# Altium schematic sheet stm32-motor4.SchDoc
size A4
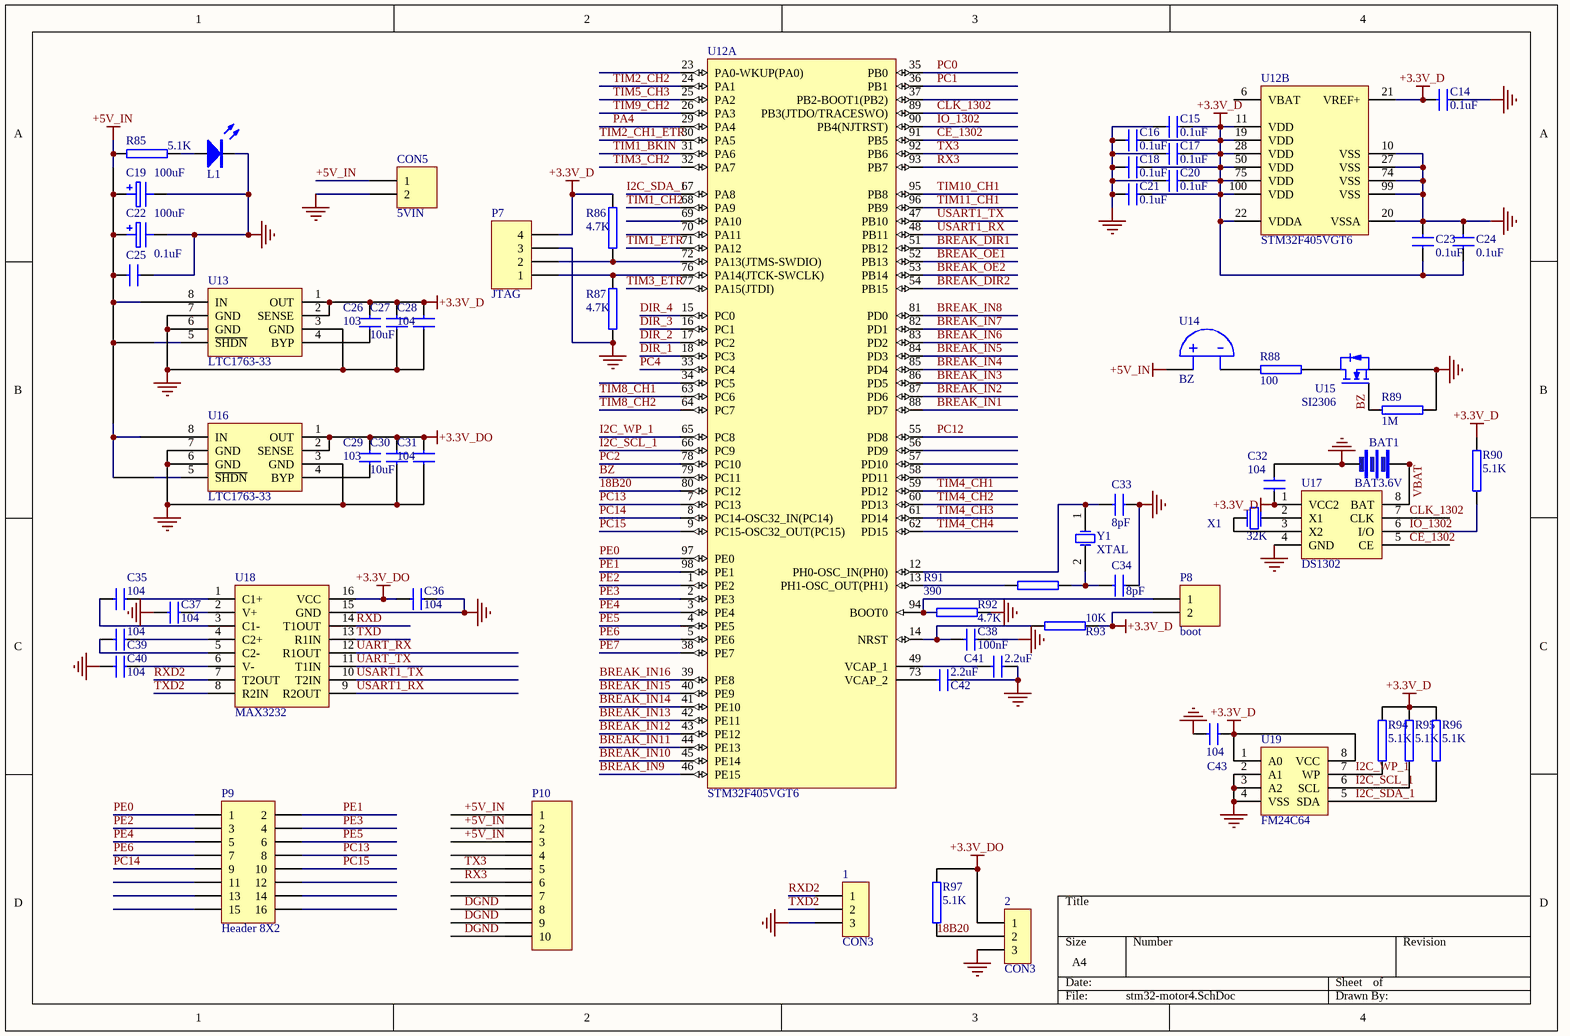
[diagram p0: stm32-motor4.SchDoc]

## Parts
1  CON3  [SIP3]
2  CON3  [SIP3]
BAT1  BAT3.6V  [BAT]
C14  0.1uF  [0805]
C15  0.1uF  [0805]
C16  0.1uF  [0805]
C17  0.1uF  [0805]
C18  0.1uF  [0805]
C19  100uF  [100UF/25V_CA]
C20  0.1uF  [0805]
C21  0.1uF  [0805]
C22  100uF  [100UF/25V_CA]
C23  0.1uF  [0805]
C24  0.1uF  [0805]
C25  0.1uF  [0805]
C26  103  [0603]
C27  10uF  [0805]
C28  104  [0805]
C29  103  [0603]
C30  10uF  [0805]
C31  104  [0805]
C32  104  [0805]
C33  8pF  [0805]
C34  8pF  [0805]
C35  104  [0805]
C36  104  [0805]
C37  104  [0805]
C38  100nF  [0805]
C39  104  [0805]
C40  104  [0805]
C41  2.2uF  [0805]
C42  2.2uF  [0805]
C43  104  [0805]
CON5  5VIN  [CON2]
L1  LED  [0805LED]  (value not drawn)
P7  JTAG  [HDR1X4]
P8  boot  [0603]
P9  Header 8X2  [HDR2X8]
P10  ping  [PCBComponent_1]  (value not drawn)
R85  5.1K  [0805]
R86  4.7K  [0805]
R87  4.7K  [0805]
R88  100  [0805]
R89  1M  [0805]
R90  5.1K  [0805]
R91  390  [0805]
R92  4.7K  [0805]
R93  10K  [0805]
R94  5.1K  [0805]
R95  5.1K  [0805]
R96  5.1K  [0805]
R97  5.1K  [0805]
U12  STM32F405VGT6  [STM-LQFP100_N]  (parts A,B of 2)
U13  LTC1763-33  [SO-8]
U14  BZ  [BZ_SMALL]
U15  SI2306  [SOT-23]
U16  LTC1763-33  [SO-8]
U17  DS1302  [SO-8]
U18  MAX3232  [SO-16]
U19  FM24C64  [SO-8]
X1  32K  [XTAL-2]
Y1  XTAL  [XTAL1]

## Nets
+3.3V_D: C14.1 C15.2 C16.2 C17.2 C18.2 C20.2 C21.2 C23.2 C24.2 C26.1 C27.1 C28.1 C32.2 C43.1 P7.4 P8.2 R86.1 R90.2 R93.2 R94.2 R95.2 R96.2 U12.11(VDD) U12.19(VDD) U12.21(VREF+) U12.22(VDDA) U12.28(VDD) U12.50(VDD) U12.75(VDD) U12.100(VDD) U13.1(OUT) U13.2(SENSE) U17.1(VCC2) U19.1(A0) U19.8(VCC)
+3.3V_DO: 2.1 C29.1 C30.1 C31.1 C36.1 R97.2 U16.1(OUT) U16.2(SENSE) U18.16(VCC)
+5V_IN: C19.1 C22.1 C25.1 CON5.1 P10.1 P10.2 P10.3 R85.2 U13.5(~{SHDN}) U13.8(IN) U14.1 U16.5(~{SHDN}) U16.8(IN)
DGND: 1.3 2.3 BAT1.2 C14.2 C15.1 C16.1 C17.1 C18.1 C19.2 C20.1 C21.1 C22.2 C23.1 C24.1 C25.2 C27.2 C28.2 C30.2 C31.2 C32.1 C33.2 C34.2 C36.2 C37.1 C38.2 C40.1 C41.2 C42.2 C43.2 CON5.2 L1.2(K) P7.3 P10.8 P10.9 P10.10 R87.2 R89.1 R92.1 U12.10(VSS) U12.20(VSSA) U12.27(VSS) U12.74(VSS) U12.99(VSS) U13.3(GND) U13.6(GND) U13.7(GND) U15.E U16.3(GND) U16.6(GND) U16.7(GND) U17.4(GND) U18.15(GND) U19.2(A1) U19.3(A2) U19.4(VSS)
18B20: 2.2 R97.1 U12.80(PC12)
BREAK_DIR1: U12.51(PB12)
BREAK_DIR2: U12.54(PB15)
BREAK_IN1: U12.88(PD7)
BREAK_IN2: U12.87(PD6)
BREAK_IN3: U12.86(PD5)
BREAK_IN4: U12.85(PD4)
BREAK_IN5: U12.84(PD3)
BREAK_IN6: U12.83(PD2)
BREAK_IN7: U12.82(PD1)
BREAK_IN8: U12.81(PD0)
BREAK_IN9: U12.46(PE15)
BREAK_IN10: U12.45(PE14)
BREAK_IN11: U12.44(PE13)
BREAK_IN12: U12.43(PE12)
BREAK_IN13: U12.42(PE11)
BREAK_IN14: U12.41(PE10)
BREAK_IN15: U12.40(PE9)
BREAK_IN16: U12.39(PE8)
BREAK_OE1: U12.52(PB13)
BREAK_OE2: U12.53(PB14)
BZ: R89.2 U12.79(PC11) U15.B
CE_1302: U12.91(PB5) U17.5(CE)
CLK_1302: U12.89(PB3(JTDO/TRACESWO)) U17.7(CLK)
DIR_1: U12.18(PC3)
DIR_2: U12.17(PC2)
DIR_3: U12.16(PC1)
DIR_4: U12.15(PC0)
I2C_SCL_1: R95.1 U12.66(PC9) U19.6(SCL)
I2C_SDA_1: R96.1 U12.67(PA8) U19.5(SDA)
I2C_WP_1: R94.1 U12.65(PC8) U19.7(WP)
IO_1302: R90.1 U12.90(PB4(NJTRST)) U17.6(I/O)
PA4: U12.29(PA4)
PC0: U12.35(PB0)
PC1: U12.36(PB1)
PC2: U12.78(PC10)
PC4: U12.33(PC4)
PC12: U12.55(PD8)
PC13: P9.8 U12.7(PC13)
PC14: P9.9 U12.8(PC14-OSC32_IN(PC14))
PC15: P9.10 U12.9(PC15-OSC32_OUT(PC15))
PE0: P9.1 U12.97(PE0)
PE1: P9.2 U12.98(PE1)
PE2: P9.3 U12.1(PE2)
PE3: P9.4 U12.2(PE3)
PE4: P9.5 U12.3(PE4)
PE5: P9.6 U12.4(PE5)
PE6: P9.7 U12.5(PE6)
PE7: U12.38(PE7)
RX3: P10.6 U12.93(PB7)
RXD: U18.14(T1OUT)
RXD2: 1.1 U18.7(T2OUT)
TIM1_BKIN: U12.31(PA6)
TIM1_CH2: U12.68(PA9)
TIM1_ETR: U12.71(PA12)
TIM2_CH1_ETR: U12.30(PA5)
TIM2_CH2: U12.24(PA1)
TIM3_CH2: U12.32(PA7)
TIM3_ETR: U12.77(PA15(JTDI))
TIM4_CH1: U12.59(PD12)
TIM4_CH2: U12.60(PD13)
TIM4_CH3: U12.61(PD14)
TIM4_CH4: U12.62(PD15)
TIM5_CH3: U12.25(PA2)
TIM8_CH1: U12.63(PC6)
TIM8_CH2: U12.64(PC7)
TIM9_CH2: U12.26(PA3)
TIM10_CH1: U12.95(PB8)
TIM11_CH1: U12.96(PB9)
TX3: P10.5 U12.92(PB6)
TXD: U18.13(R1IN)
TXD2: 1.2 U18.8(R2IN)
UART_RX: U18.12(R1OUT)
UART_TX: U18.11(T1IN)
USART1_RX: U12.48(PB11) U18.9(R2OUT)
USART1_TX: U12.47(PB10) U18.10(T2IN)
VBAT: BAT1.1 U17.8(BAT)
NetC26_2: C26.2 U13.4(BYP)
NetC29_2: C29.2 U16.4(BYP)
NetC33_1: C33.1 U12.12(PH0-OSC_IN(PH0)) Y1.1(OSC1)
NetC34_1: C34.1 R91.2 Y1.2(OSC2)
NetC35_1: C35.1 U18.3(C1-)
NetC35_2: C35.2 U18.1(C1+)
NetC37_2: C37.2 U18.2(V+)
NetC38_1: C38.1 R93.1 U12.14(NRST)
NetC39_1: C39.1 U18.5(C2-)
NetC39_2: C39.2 U18.4(C2+)
NetC40_2: C40.2 U18.6(V-)
NetC41_1: C41.1 U12.49(VCAP_1)
NetC42_1: C42.1 U12.73(VCAP_2)
NetL1_1: L1.1(A) R85.1
NetP7_1: P7.1 R87.1 U12.76(PA14(JTCK-SWCLK))
NetP7_2: P7.2 R86.2 U12.72(PA13(JTMS-SWDIO))
NetP8_1: P8.1 R92.2 U12.94(BOOT0)
NetR88_1: R88.1 U15.C
NetR88_2: R88.2 U14.2
NetR91_1: R91.1 U12.13(PH1-OSC_OUT(PH1))
NetU17_2: U17.2(X1) X1.2(P2)
NetU17_3: U17.3(X2) X1.1(P1)

Not connected (* = marked no-connect by the designer): P9 11 12 13 14 15 16; P10 4 7; U12 6(VBAT) 23(PA0-WKUP(PA0)) 34(PC5) 37(PB2-BOOT1(PB2)) 56(PD9) 57(PD10) 58(PD11) 69(PA10) 70(PA11)

## Library data of the parts
1 2 = CON3: Connector
C14-C18 C20 C21 C23-C43 = C
C19 C22 = ELECTRO1
CON5 P8 = Header 2: Header, 2-Pin; Publisher: Altium Limited
  CON5: Revision: 17-Jul-2002: Re-released for DXP Platform.
  P8: LatestRevisionDate: 17-Jul-2002; LatestRevisionNote: Re-released for DXP Platform.
P7 = Header 4: Header, 4-Pin; LatestRevisionDate: 17-Jul-2002; LatestRevisionNote: Re-released for DXP Platform.; Publisher: Altium Limited
P9 = Header 8X2: Header, 8-Pin, Dual row; LatestRevisionDate: 17-Jul-2002; LatestRevisionNote: Re-released for DXP Platform.; Publisher: Altium Limited
P10 = Header 10: Header, 10-Pin; LatestRevisionDate: 17-Jul-2002; LatestRevisionNote: Re-released for DXP Platform.; Publisher: Altium Limited
R85-R97 = RES
U12 = STM32F405VGT6: ARM Cortex-M4 32-bit MCU+FPU, 210 DMIPS, 1024 kB Flash, 192 kB Internal RAM, 82 I/Os, 100-pin LQFP, -40 to 85 degC, Tray; Manufacturer: STMicroelectronics; D/A Converter: 2x12-bit; FLASH Size (Prog) (kB): 1024; I/Os (High Current): 82; Internal RAM Size (kB): 192; Operating Frequency(F) (Processor speed) (MHz): 168; Supply Voltage(Vcc) max (V): 3.6; Supply Voltage(Vcc) min (V): 1.8; DatasheetVersion: Rev. 4; PackageVersion: Rev. 1, 06/2013; PackageReference: LQFP100; PackageDescription: 100-Pin Low Profile Quad Flat Package, 14 x 14 mm Body, 0.5 mm Pitch; Supplier 1: Digi-Key; Supplier Part Number 1: 497-11910-ND; Supplier 2: Farnell; Supplier Part Number 2: 2215224; Supplier 3: Newark; Supplier Part Number 3: 46W2199; Supplier 4: Newark; Supplier Part Number 4: 94T6493; Supplier 5: Mouser; Supplier Part Number 5: 511-STM32F405VGT6; Core: ARM Cortex-M4; Packing: Tray; Mounting Technology: Surface Mount; PartNumber: STM32F405VGT6; ComponentLink1Description: Manufacturer URL; ComponentLink1URL: http://www.st.com/web/en/home.html; ComponentLink2Description: Datasheet; ComponentLink2URL: http://www.st.com/st-web-ui/static/active/en/resource/technical/document/datasheet/DM00037051.pdf; ComponentLink3Description: Package Specification; ComponentLink3URL: http://www.st.com/st-web-ui/static/active/en/resource/technical/document/data_brief/DM00071938.pdf
U13 U16 = LT1763
U15 = MOFET_N
X1 = XTAL
Y1 = XTAL: Crystal Oscillator; Published: 8-Jun-2000; LatestRevisionDate: 17-Jul-2002; LatestRevisionNote: Re-released for DXP Platform.; PackageReference: R38; Publisher: Altium Limited; PackageDescription: Crystal, Thru-Hole; 2 Leads; Body 3.1 x 8.2 mm (Dia.xH)